# Altium schematic sheet 07_ADC.SchDoc: ADC
size A4; Date: 20/11/2014; Author: HuangRui <vowstar@gmail.com>; DrawnBy: JiYaping <jyp1817@gmail.com>; Organization: WWW.NODEMCU.COM
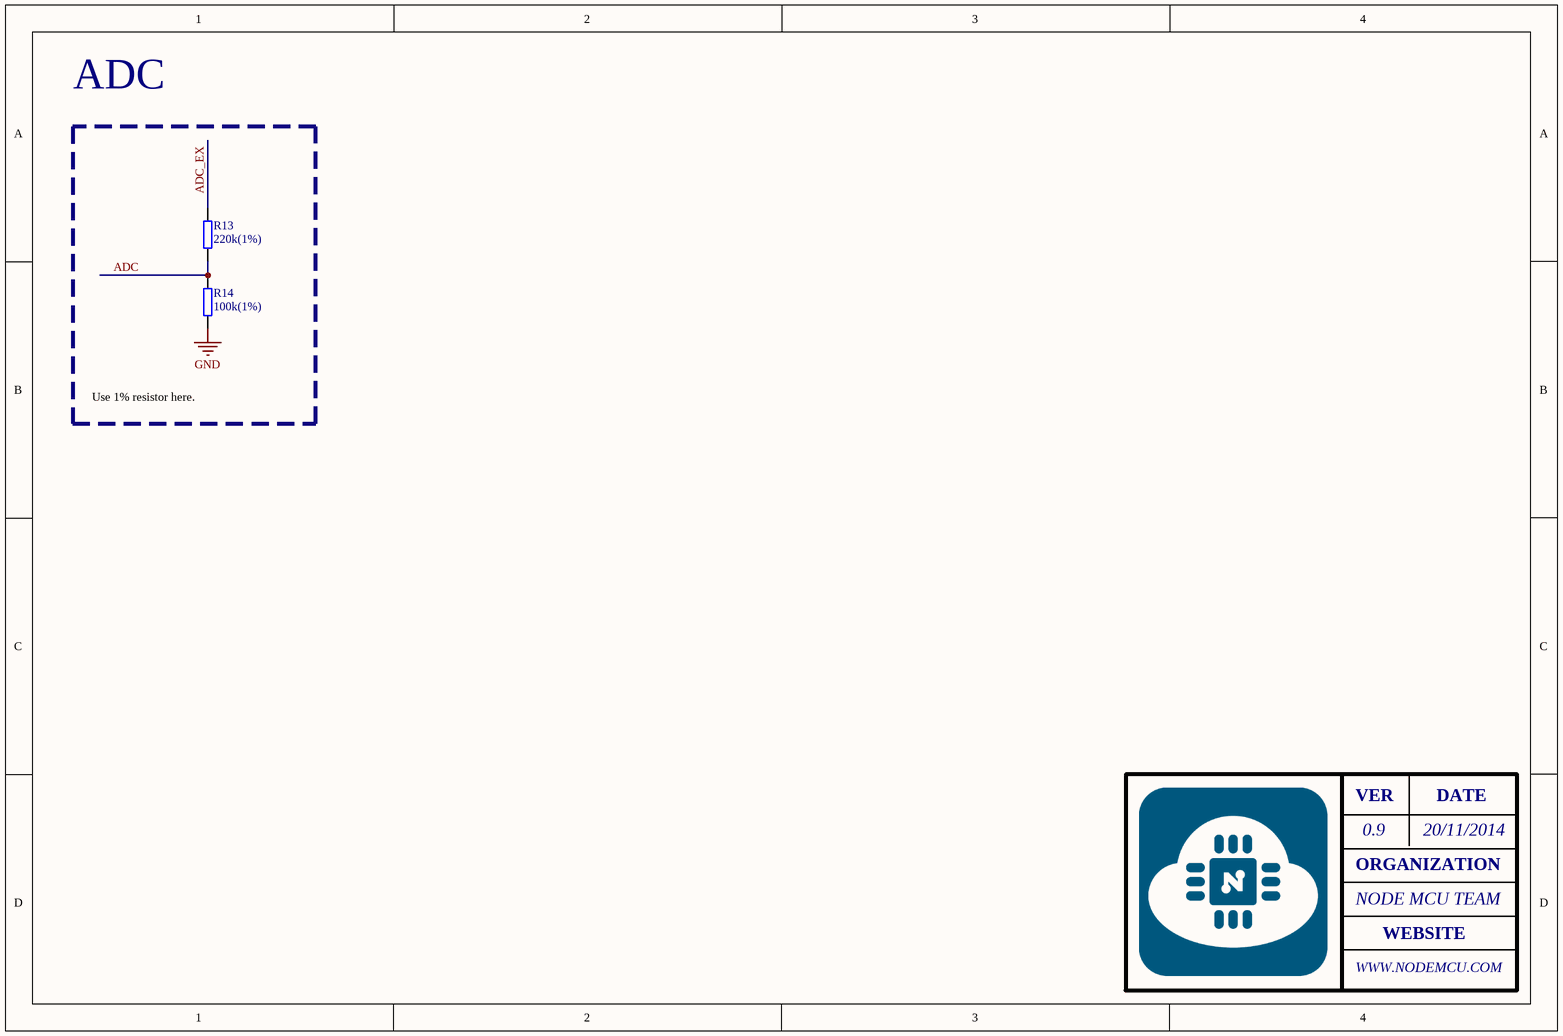
[diagram p0: 07_ADC.SchDoc]

## Parts
R13  220k(1%)  [SMT_R_0402]
R14  100k(1%)  [SMT_R_0402]

## Nets
GND: R14.1
ADC: R13.1 R14.2
ADC_EX: R13.2

## Notes on the sheet
- Use 1% resistor here.
- VER
- 0.9
- DATE
- ORGANIZATION
- NODE MCU TEAM
- WEBSITE

## Library data of the parts
R13 R14 = SMT_R_0402: Surface mount resistor 0402